# EAGLE design expansion_module_spi_flash (EAGLE 9.6.2)
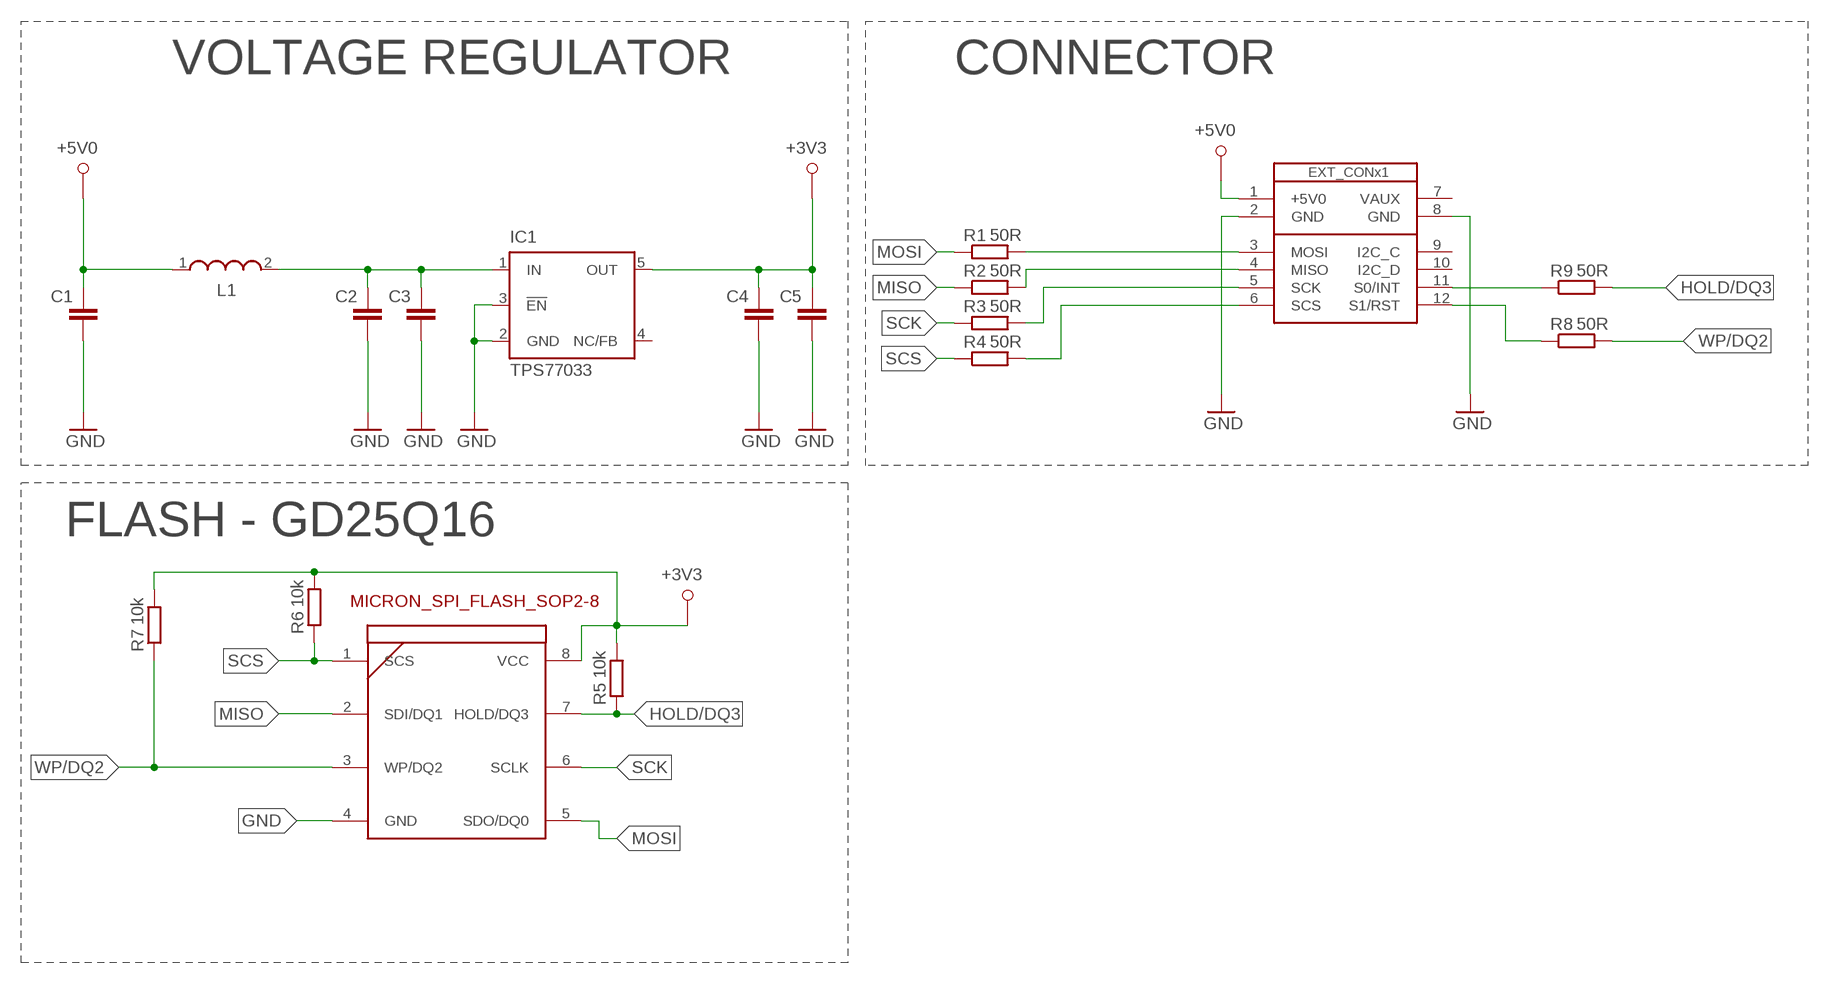
[diagram p0: schematic, sheet 1]

## Parts
C1  C-EUC0805  [C0805]
C2  C-EUC0805  [C0805]
C3  C-EUC0805  [C0805]
C4  C-EUC0805  [C0805]
C5  C-EUC0805  [C0805]
IC1  TPS77033  [SOT23-DBV]
L1  WE-LQ_1210  [WE-LQ_M]
R1  50R  R-EU_R0805  [R0805]
R2  50R  R-EU_R0805  [R0805]
R3  50R  R-EU_R0805  [R0805]
R4  50R  R-EU_R0805  [R0805]
R5  10k  R-EU_R0805  [R0805]
R6  10k  R-EU_R0805  [R0805]
R7  10k  R-EU_R0805  [R0805]
R8  50R  R-EU_R0805  [R0805]
R9  50R  R-EU_R0805  [R0805]
U$1  SB_EXT_CON_X1_SPI  [SB_EXT_CON_X1_FULL]
U$11  MICRON_SPI_FLASH  [SO-08M]

## Nets
+3V3: C4.2 C5.2 IC1.5(OUT) R5.2 R6.2 R7.2 U$11.8(VCC)
+5V0: C1.2 L1.1 U$1.1(+5V0)
GND: C1.1 C2.1 C3.1 C4.1 C5.1 IC1.2(GND) IC1.3(!EN) U$1.2(GND) U$1.8(GND) U$11.4(GND)
HOLD/DQ3: R5.1 R9.2 U$11.7(HOLD/DQ3)
MISO: R2.1 U$11.2(SDI/DQ1)
MOSI: R1.1 U$11.5(SDO/DQ0)
N$1: R1.2 U$1.3(MOSI)
N$2: R2.2 U$1.4(MISO)
N$3: R3.2 U$1.5(SCK)
N$4: R4.2 U$1.6(SCS)
N$5: R8.1 U$1.12(S1/RST)
N$6: R9.1 U$1.11(S0/INT)
N$8: C2.2 C3.2 IC1.1(IN) L1.2
SCK: R3.1 U$11.6(SCLK)
SCS: R4.1 R6.1 U$11.1(SCS)
WP/DQ2: R7.1 R8.2 U$11.3(WP/DQ2)
Unconnected: IC1.4(NC/FB) U$1.7(VAUX) U$1.9(I2C_C) U$1.10(I2C_D)

## Notes on the sheet
- VOLTAGE REGULATOR | CONNECTOR
- FLASH - GD25Q16

## Library data of the parts
C1-C5 = resistor:C-EU: CAPACITOR, European symbol
IC1 = texas:TPS770*: ULTRALOW-POWER 50-mA LOW-DROPOUT LINEAR REGULATORS 50-mA Low-Dropout Regulator Source: http://focus.ti.com/lit/ds/symlink/tps77001.pdf; MF: TEXAS INSTRUMENTS; MPN: TPS77033DBVT; OC_FARNELL: 8461570; OC_NEWARK: 77C1187
L1 = EagleLibrary_Wuerth_Elektronik_eiSos_rev16a:WE-LQ: SMD Inductor Characteristics Miniature chip inductor wound on a special ferrite core Small inductances for compact circuits High Q at high frequencies Low DC-resistance Operating temperature: –40 ºC to +125 ºC Applications Low power DC/DC-converters from Linear Technology, National Semiconductor, Texas Instruments, Fairchild Semiconductor, ON Semiconductor, STMicroelectronics, Maxim, MPS, Semtech, Exar, Analogic Tech, Diodes and Cologne Chip EMI-Filtering RF-circuits <http://katalog.we-online.de/media/images/eisos/IndLQ_pf2.jpg> Details see: http://katalog.we-online.de/en/pbs/WE-LQ? Updated by Dan Xu 2014-07-08 2014 (C) Wurth Elektronik
R1-R9 = resistor:R-EU_: RESISTOR, European symbol
U$1 = al_smartboard:SB_EXT_CON_X1_SPI
U$11 = al_smartboard:MICRON_SPI_FLASH

## Net classes
0 default: clearance 0.205 mm

## Board
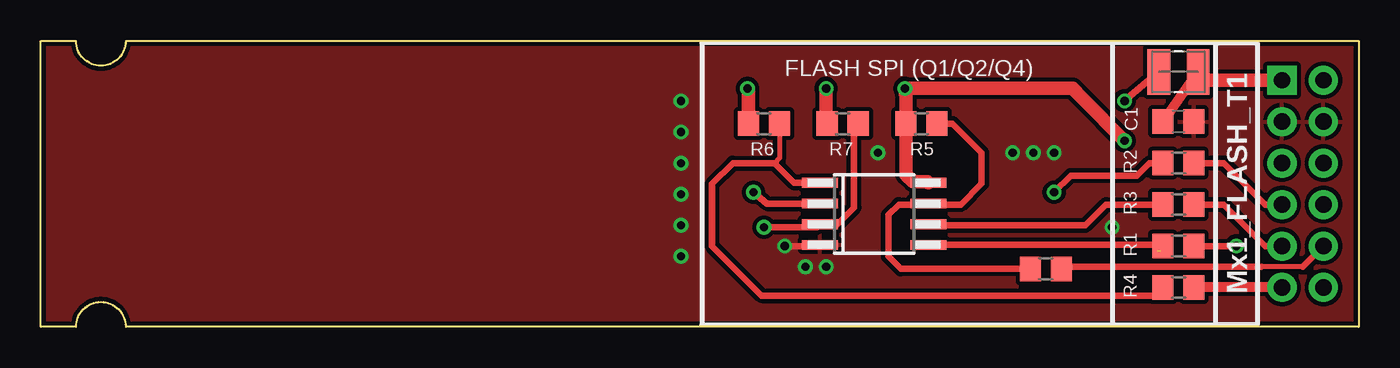
[diagram p1: board, top side]
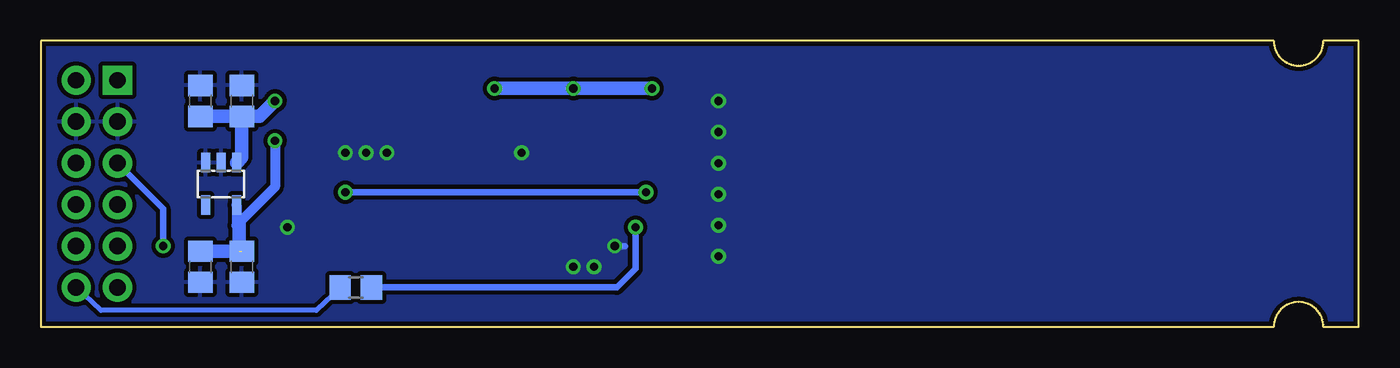
[diagram p2: board, bottom side, seen from below]

Size 80.77 x 17.53 mm. Coordinates in mm from the lower left corner, seen from the top.
Copper layers (1*16): Top 0.035mm / dielectric 1.5mm / Bottom 0.035mm
Design rules "default *": minimum track width 10mil, minimum drill 24mil, track to track 8mil, track to pad 8mil, pad to pad 8mil, via to via 8mil, smd to smd 8mil, copper to edge 10mil, drill to drill 20mil, minimum pad ring 10mil, minimum via ring 8mil, stop-mask expansion 4mil, vias tented up to drill 30mil, thermal gap 10mil

### Footprints (pad centres in the part's own frame; a part is rotated, then mirrored left to right if it is on the bottom)
C0805 = smd 1.3 x 1.5: 1 -0.95,0; 2 0.95,0
SOT23-DBV = smd 0.55 x 1.2: 1 -0.95,-1.3; 2 0,-1.3; 3 0.95,-1.3; 4 0.95,1.3; 5 -0.95,1.3
WE-LQ_M = smd 1.4 x 2.8: 1 -1.2,0; 2 1.2,0
R0805 = smd 1.3 x 1.5: 1 -0.95,0; 2 0.95,0
SB_EXT_CON_X1_FULL = drill 1 pad 1.778 square: 1 15.24,5.08 | drill 1 pad 1.778: 2 12.7,5.08; 3 10.16,5.08; 4 7.62,5.08; 5 5.08,5.08; 6 2.54,5.08; 7 15.24,2.54; 8 12.7,2.54; 9 10.16,2.54; 10 7.62,2.54; 11 5.08,2.54; 12 2.54,2.54
SO-08M = smd 0.6 x 2.2: 1 -1.905,-3.33; 2 -0.635,-3.33; 3 0.635,-3.33; 4 1.905,-3.33; 5 1.905,3.33; 6 0.635,3.33; 7 -0.635,3.33; 8 -1.905,3.33

### Placement (x,y rotation side)
C1  69.72,12.57 180 top
C2  70.99,13.84 270 bottom
C3  68.45,13.84 270 bottom
C4  68.45,3.68 90 bottom
C5  70.99,3.68 90 bottom
IC1  69.72,8.76 180 bottom
L1  69.72,15.62 180 top
R1  69.72,4.95 0 top
R2  69.72,10.03 0 top
R3  69.72,7.49 0 top
R4  69.72,2.41 0 top
R5  53.97,12.45 180 top
R6  44.32,12.45 180 top
R7  49.15,12.45 180 top
R8  61.47,2.41 0 bottom
R9  61.59,3.56 180 top
U$1  81.15,-0.13 90 top
U$11  51.08,6.92 270 top

### Tracks (layer width: path | path; a pad name or v marks a point on that pad's centre or on a via)
+3V3  (via drill 0.5)  (1 unrouted)
  Top 0.305: 47.94,12.57 47.94,14.42 v48.13,14.6
  Top 0.813: 63.37,14.48 63.82,14.03 | 63.82,14.03 v66.42,11.4 66.42,11.43 | U$11.8 54.35,8.89 53.47,8.89 53.03,9.33 R5.2 53.03,14.03 v52.96,14.6 63.24,14.6 63.82,14.03 | v48.13,14.6 48.13,12.57 47.94,12.57 R7.2 | R6.2 43.37,14.54 v43.31,14.6
  Bottom 0.61: IC1.5 68.77,6.22 68.61,6.38 66.42,8.57 v66.42,11.4
  Bottom 0.813: C5.2 68.61,4.63 68.61,6.38 | v52.96,14.6 v48.13,14.6 v43.31,14.6
+5V0
  Top 0.61: L1.1 C1.2
  Top 0.813: U$1.1 71.43,15.11 L1.1
GND  (via drill 0.5)
  Top 0.406: U$11.4 47.68,4.95 v45.59,4.95
  Bottom 0.406: v45.59,4.95 44.96,4.95
  other vias: 59.56,10.67 60.83,10.67 62.1,10.67 46.86,3.68 48.13,3.68 51.31,10.67 39.24,13.84 39.24,11.94 39.24,10.03 39.24,8.13 39.24,6.22 39.24,4.32 65.66,6.1
  pour Bottom (isolate 0.254): -0.13,17.65 81.15,17.91 81.15,-0.13 -0.13,-0.13
  pour Top (isolate 0.254): -0.13,17.65 81.15,17.65 81.15,-0.13 -0.13,-0.13
HOLD/DQ3
  Top 0.406: R5.1 55.88,12.45 57.66,10.67 57.66,8.76 56.39,7.49 54.47,7.49 U$11.7 54.34,7.49 52.58,7.49 51.94,6.86 51.94,4.32 52.7,3.56 R9.2
MISO  (via drill 0.5)
  Top 0.406: v43.69,8.25 44.52,7.56 U$11.2 | R2.1 67.94,10.03 67.18,9.27 63.12,9.27 v62.1,8.25
  Bottom 0.406: v43.69,8.25 v62.1,8.25
MOSI
  Top 0.406: U$11.5 68.71,5.02 R1.1
N$1  (via drill 0.5)
  Top 0.406: R1.2 v73.28,4.95
  Bottom 0.406: U$1.3 73.28,7.24 v73.28,4.95
N$2
  Top 0.406: U$1.4 75.06,7.49 72.52,10.03 R2.2
N$3
  Top 0.406: U$1.5 75.06,4.95 72.52,7.49 R3.2
N$4
  Top 0.61: U$1.6 R4.2
N$5
  Bottom 0.305: 62.42,2.35 63.88,1.02 77.09,1.02 U$1.12
  Bottom 0.406: R8.1 62.42,2.35
  Bottom 0.61: 78.61,2.16 U$1.12
N$6
  Top 0.305: 77.34,3.68 74.8,3.68
  Top 0.406: U$1.11 77.34,3.68 | 62.74,3.68 R9.1 62.61,3.56 62.74,3.68 | 74.8,3.68 62.74,3.68
N$8  (via drill 0.5)
  Top 0.406: v66.42,13.84 L1.2
  Bottom 0.813: v66.42,13.84 67.37,12.89 C3.2 | C3.2 C2.2 | IC1.1 68.45,10.38 C3.2
SCK
  Top 0.406: U$11.6 54.47,6.22 64.01,6.22 65.28,7.49 R3.1
SCS
  Top 0.305: R6.1 45.27,10.35 44.96,10.03
  Top 0.406: U$11.1 46.16,8.83 44.96,10.03 42.42,10.03 41.15,8.76 41.15,4.95 44.18,1.92 68.28,1.92 R4.1
WP/DQ2  (via drill 0.5)
  Top 0.406: v44.32,6.1 47.56,6.1 U$11.3 47.81,6.22 48.77,6.22 49.84,7.3 49.84,12.19 R7.1
  Bottom 0.406: v44.32,6.1 44.32,3.56 45.47,2.41 R8.2

### Text on the board
tPlace: FLASH SPI (Q1/Q2/Q4) | Mx1_FLASH_T1